# EAGLE design H_V21 (EAGLE 4.13)
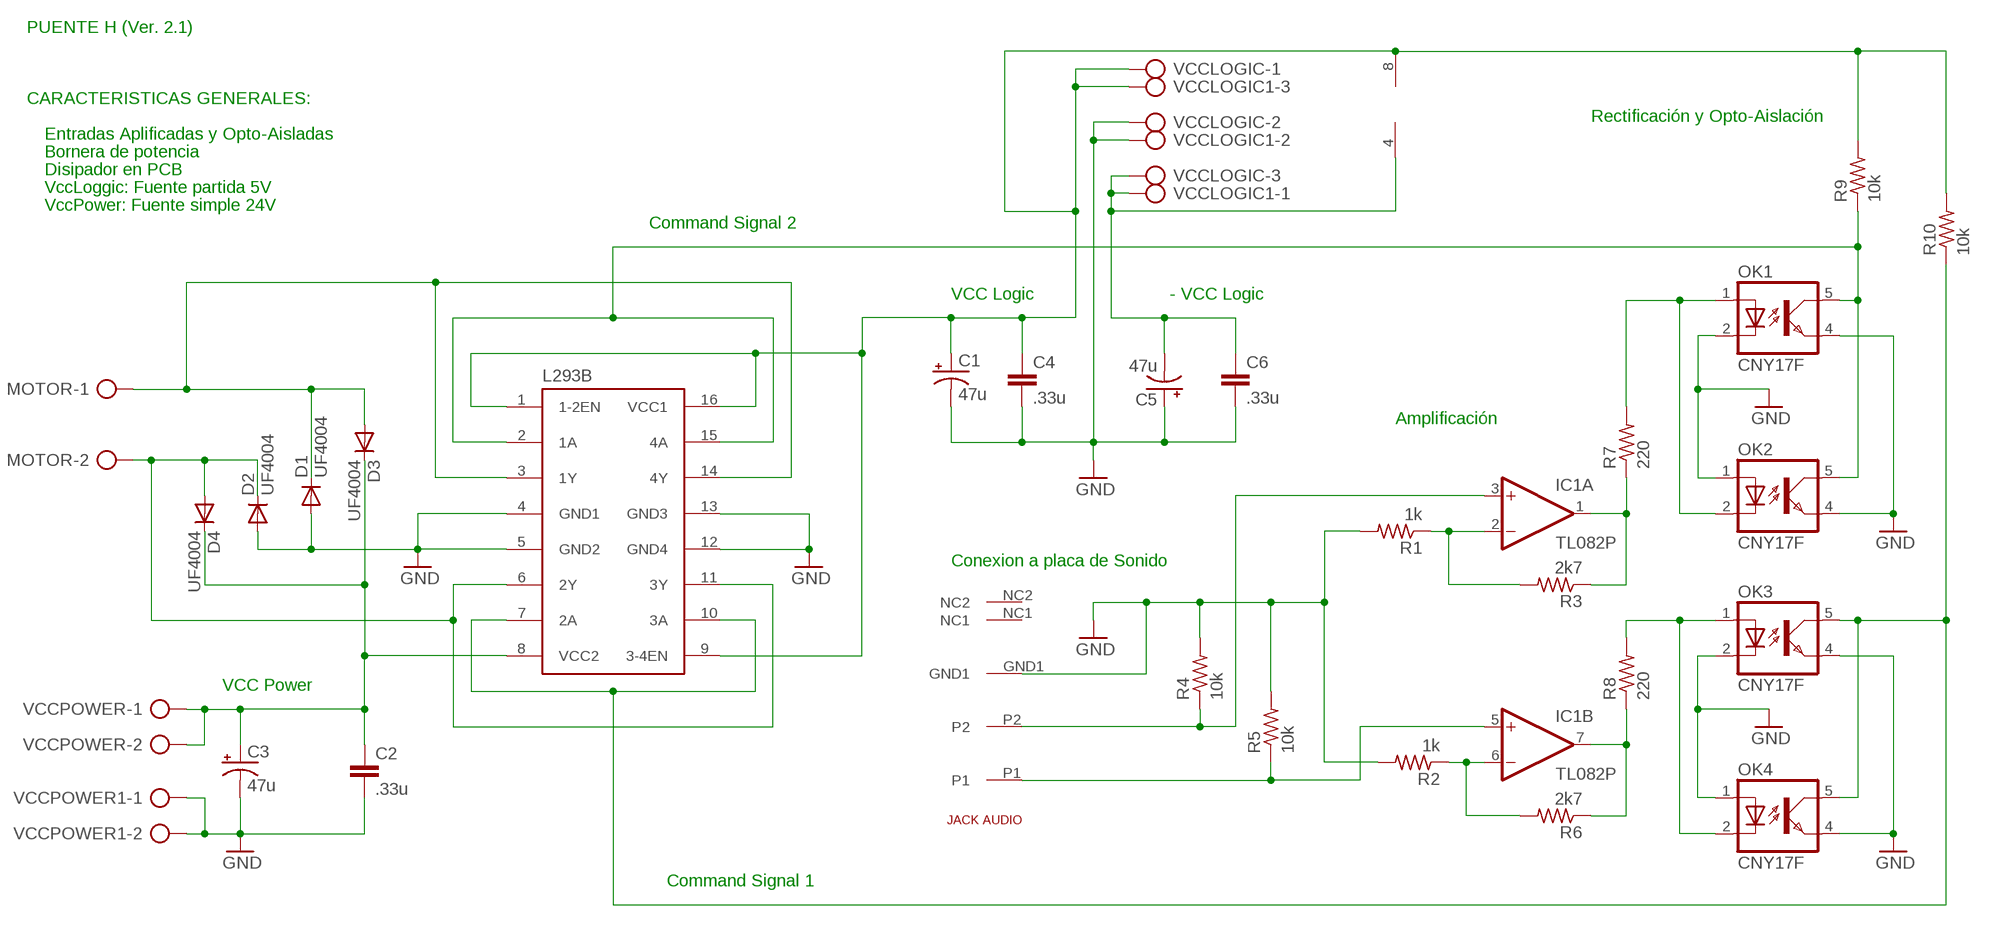
[diagram p0: schematic, sheet 1]

## Parts
C1  47u  CPOL-USE3.5-8  [E3,5-8]
C2  .33u  C2,5-3  [C2.5-3]
C3  47u  CPOL-USE3.5-8  [E3,5-8]
C4  .33u  C2,5-3  [C2.5-3]
C5  47u  CPOL-USE3.5-8  [E3,5-8]
C6  .33u  C2,5-3  [C2.5-3]
D1  UF4004  1N4004  [DO41-10]
D2  UF4004  1N4004  [DO41-10]
D3  UF4004  1N4004  [DO41-10]
D4  UF4004  1N4004  [DO41-10]
IC1  TL082P  [DIL08]
JACKAUDIO1  JACKAUDIO  [ZOCALOGUS]
L293B  L293E  [DIL16]
MOTOR  AK300/2  [AK300/2]
OK1  CNY17F  [DIL06]
OK2  CNY17F  [DIL06]
OK3  CNY17F  [DIL06]
OK4  CNY17F  [DIL06]
R1  1k  R-US_0207/12  [0207/12]
R2  1k  R-US_0207/12  [0207/12]
R3  2k7  R-US_0207/12  [0207/12]
R4  10k  R-US_0207/12  [0207/12]
R5  10k  R-US_0207/12  [0207/12]
R6  2k7  R-US_0207/12  [0207/12]
R7  220  R-US_0207/12  [0207/12]
R8  220  R-US_0207/12  [0207/12]
R9  10k  R-US_0207/12  [0207/12]
R10  10k  R-US_0207/12  [0207/12]
VCCLOGIC  AK500/3  [AK500/3]
VCCLOGIC1  AK500/3  [AK500/3]
VCCPOWER  AK300/2  [AK300/2]
VCCPOWER1  AK300/2  [AK300/2]

## Nets
GND: C1.- C2.2 C3.- C4.2 C5.+ C6.2 D1.A D2.A JACKAUDIO1.GND1 L293B.4(GND1) L293B.5(GND2) L293B.12(GND4) L293B.13(GND3) OK1.2(C) OK1.4(EMIT) OK2.1(A) OK2.4(EMIT) OK3.2(C) OK3.4(EMIT) OK4.1(A) OK4.4(EMIT) R1.2 R2.2 R4.2 R5.2 VCCLOGIC1.2 VCCLOGIC.2 VCCPOWER1.1 VCCPOWER1.2
N$1: L293B.7(2A) L293B.10(3A) OK3.5(COL) OK4.5(COL) R10.1
N$2: L293B.2(1A) L293B.15(4A) OK1.5(COL) OK2.5(COL) R9.1
N$3: OK3.1(A) OK4.2(C) R8.2
N$5: C1.+ C4.1 IC1.8(P:V+) L293B.1(1-2EN) L293B.9(3-4EN) L293B.16(VCC1) R9.2 R10.2 VCCLOGIC1.3 VCCLOGIC.1
N$6: IC1.5(B:+IN) JACKAUDIO1.P1 R5.1
N$7: IC1.3(A:+IN) JACKAUDIO1.P2 R4.1
N$8: C2.1 C3.+ D3.C D4.C L293B.8(VCC2) VCCPOWER.1 VCCPOWER.2
N$9: IC1.2(A:-IN) R1.1 R3.2
N$10: D2.C D4.A L293B.6(2Y) L293B.11(3Y) MOTOR.2
N$11: D1.C D3.A L293B.3(1Y) L293B.14(4Y) MOTOR.1
N$12: IC1.6(B:-IN) R2.1 R6.2
N$13: OK1.1(A) OK2.2(C) R7.2
N$14: C5.- C6.1 IC1.4(P:V-) VCCLOGIC1.1 VCCLOGIC.3
N$16: IC1.1(A:OUT) R3.1 R7.1
N$17: IC1.7(B:OUT) R6.1 R8.1
Unconnected: JACKAUDIO1.NC1 JACKAUDIO1.NC2

## Notes on the sheet
- PUENTE H (Ver. 2.1)
- CARACTERISTICAS GENERALES:
- Rectificación y Opto-Aislación
- Entradas Aplificadas y Opto-Aisladas
- Bornera de potencia
- Disipador en PCB
- VccLoggic: Fuente partida 5V
- VccPower: Fuente simple 24V
- Command Signal 2
- VCC Logic | - VCC Logic
- Amplificación
- Conexion a placa de Sonido
- VCC Power
- Command Signal 1

## Library data of the parts
C1 C3 C5 = rcl:CPOL-US: POLARIZED CAPACITOR, American symbol
C2 C4 C6 = capacitor-wima:C: CAPACITOR naming: grid - package width
D1-D4 = diode:1N4004: DIODE general purpose rectifier, 1 A
IC1 = linear:TL082: OP AMP
JACKAUDIO1 = con-gus:JACKAUDIO
L293B = texas:L293E: TI DEVICE
MOTOR VCCPOWER VCCPOWER1 = con-ptr500:AK300/2: CONNECTOR
OK1-OK4 = optocoupler:CNY17F: SIEMENS OPTO COUPLER
R1-R10 = rcl:R-US_: RESISTOR, American symbol
VCCLOGIC VCCLOGIC1 = con-ptr500:AK500/3: CONNECTOR

## Board
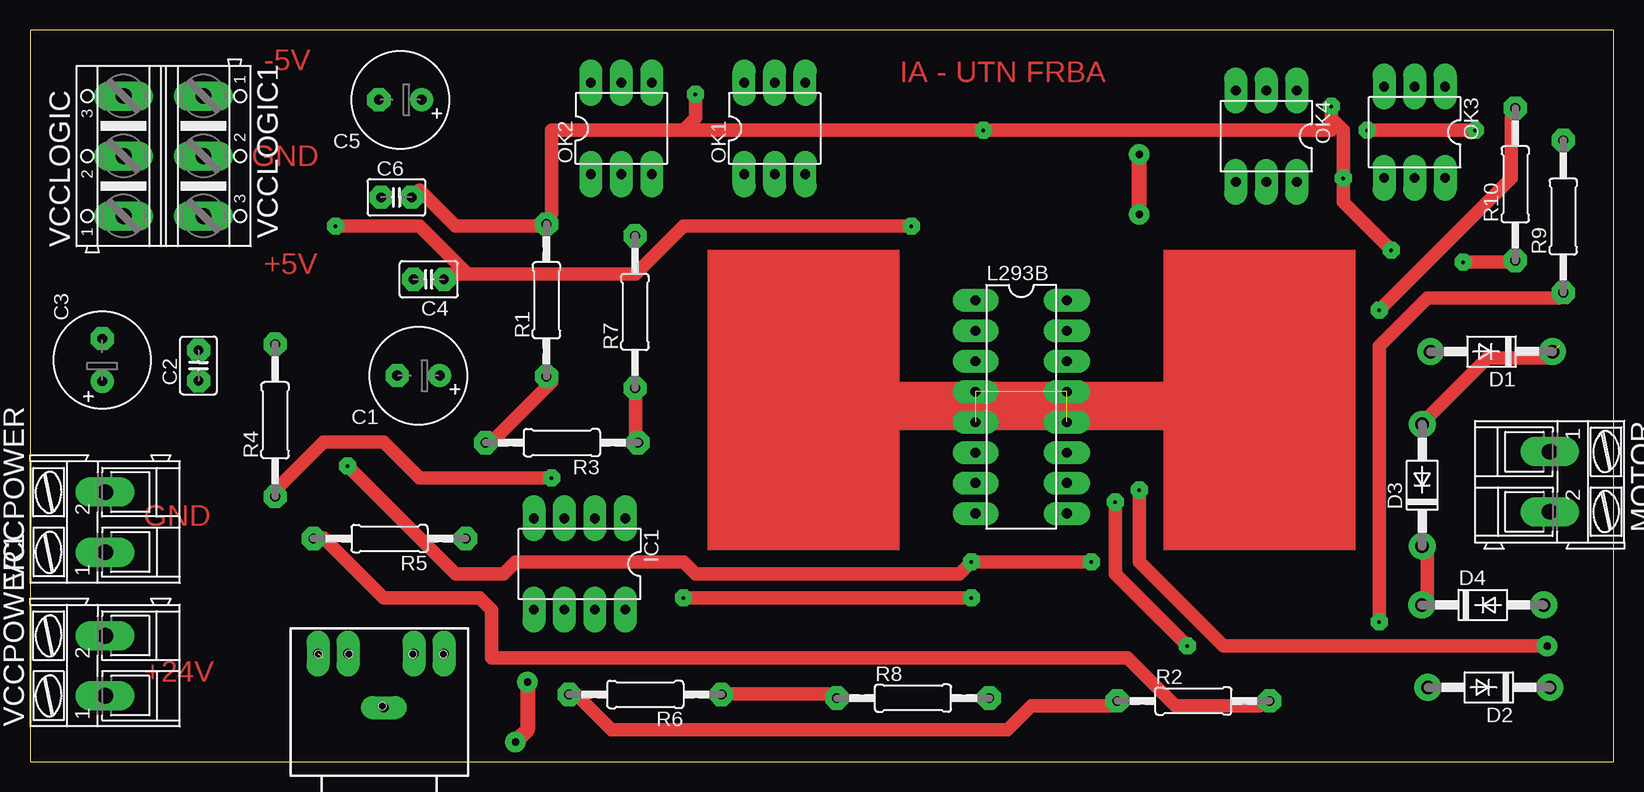
[diagram p1: board, top side]
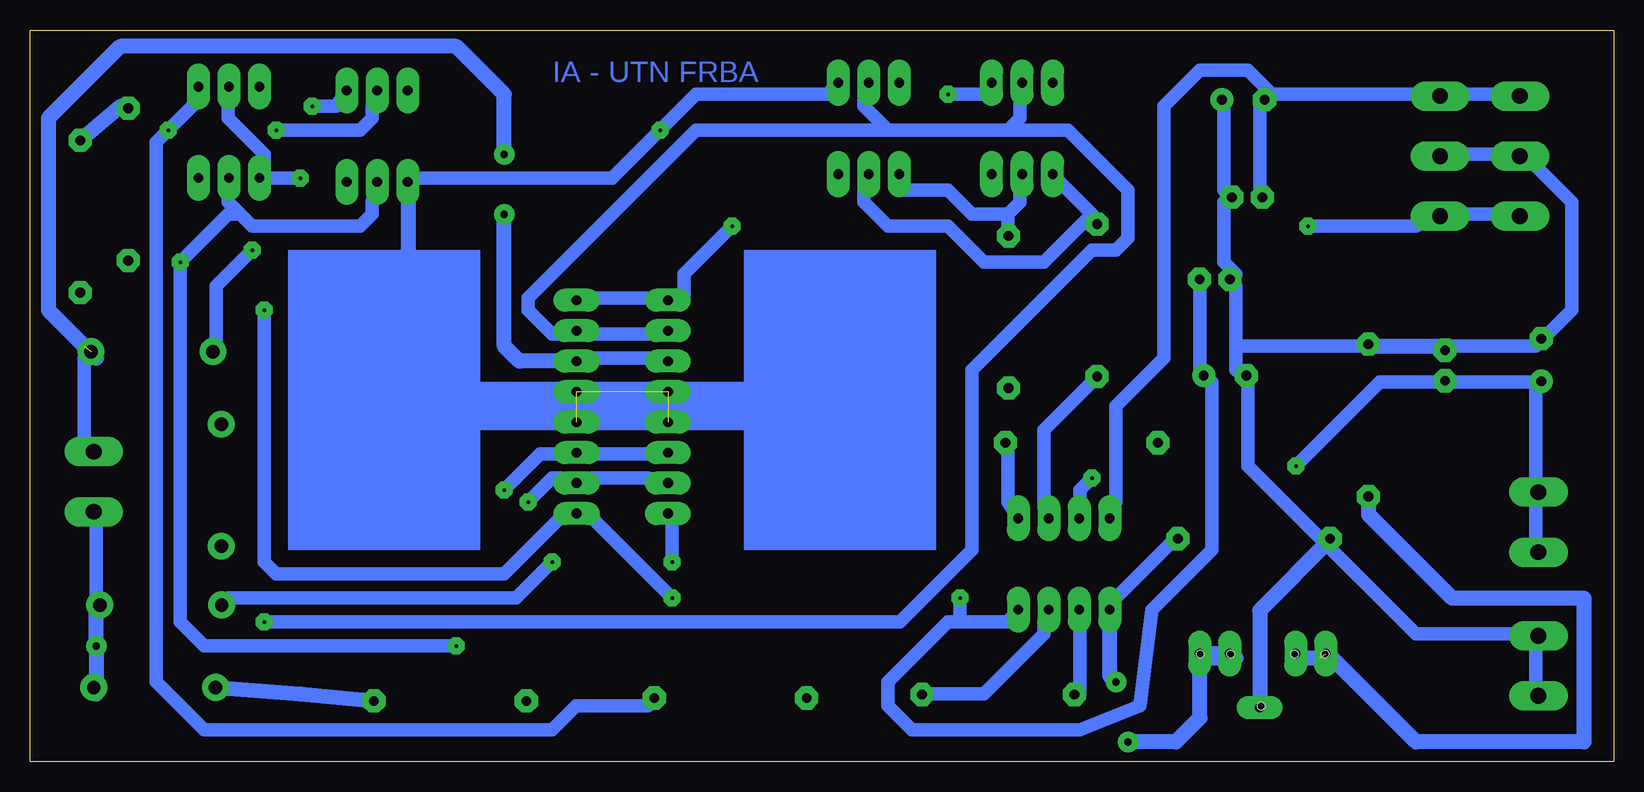
[diagram p2: board, bottom side, seen from below]

Size 132 x 61 mm. Coordinates in mm from the lower left corner, seen from the top.
Outline: 0,0 132,0 132,61 0,61 0,0
Copper layers (1*16): Top 0.035mm / dielectric 1.5mm / Bottom 0.035mm
Design rules "default": minimum track width 44mil, minimum drill 12mil, track to track 22mil, track to pad 22mil, pad to pad 22mil, via to via 22mil, smd to smd 8mil, copper to edge 40mil, drill to drill 8mil, minimum pad ring 22mil, minimum via ring 22mil, stop-mask expansion 4mil, vias tented up to drill 0mil, thermal gap 10mil
tRestrict: area 2.5,41.6 to 19.5,58.6; area 2.5,3.6 to 11.5,24.6; area 21.5,2.6 to 37.5,12.6; area 76.5,17.6 to 89.5,42.6; area 39.5,17.6 to 52.5,22.6; area 39.5,9.6 to 52.5,14.6; area 44.5,53.6 to 54.5,59.6; area 44.5,46.6 to 54.5,51.6; area 57.5,54.6 to 67.5,59.6; area 57.5,46.6 to 67.5,50.6; area 97.5,53.6 to 107.5,58.6; area 97.5,46.6 to 108.5,51.6; 6 more areas
vRestrict: area 60.5,17.6 to 72.5,42.6; area 94.5,17.6 to 106.5,42.6; area 72.5,27.6 to 94.5,31.6; area 56.5,17.6 to 60.5,42.6; area 106.5,17.6 to 110.5,42.6

### Footprints (pad centres in the part's own frame; a part is rotated, then mirrored left to right if it is on the bottom)
E3,5-8 = drill 0.813 pad 1.6 round: + -1.778,0 | drill 0.813 pad 1.6 octagon: - 1.778,0
C2.5-3 = drill 0.813 pad 1.6 octagon: 1 -1.27,0; 2 1.27,0
DO41-10 = drill 1.118 round: A 5.08,0; C -5.08,0
DIL08 = drill 0.813 long: 1 -3.81,-3.81; 2 -1.27,-3.81; 3 1.27,-3.81; 4 3.81,-3.81; 5 3.81,3.81; 6 1.27,3.81; 7 -1.27,3.81; 8 -3.81,3.81
ZOCALOGUS = drill 0.8 long: GND1 7.5,7; NC1 5,2.5; NC2 10.5,2.5; P1 2.5,2.5; P2 13,2.5 | hole 0.6: 2.54,2.54; 12.97,2.54; 5.08,2.54; 10.43,2.54; 7.62,6.89
DIL16 = drill 0.813 long: 1 -8.89,-3.81; 2 -6.35,-3.81; 3 -3.81,-3.81; 4 -1.27,-3.81; 5 1.27,-3.81; 6 3.81,-3.81; 7 6.35,-3.81; 8 8.89,-3.81; 9 8.89,3.81; 10 6.35,3.81; 11 3.81,3.81; 12 1.27,3.81; 13 -1.27,3.81; 14 -3.81,3.81; 15 -6.35,3.81; 16 -8.89,3.81
AK300/2 = drill 1.321 long: 1 -2.515,0; 2 2.489,0
DIL06 = drill 0.813 long: 1 -2.54,-3.81; 2 0,-3.81; 3 2.54,-3.81; 4 2.54,3.81; 5 0,3.81; 6 -2.54,3.81
0207/12 = drill 0.813 octagon: 1 -6.35,0; 2 6.35,0
AK500/3 = drill 1.321 long: 1 -5.004,0; 2 0,0; 3 5.004,0

### Placement (x,y rotation side)
C1  32.38,32.18 180 top
C2  14.05,33.02 90 top
C3  6.02,33.48 90 top
C4  33.24,40.21 180 top
C5  30.86,55.18 180 top
C6  30.54,47.05 0 top
D1  121.83,34.18 180 top
D2  121.61,6.18 180 top
D3  116.05,23.04 90 top
D4  121.1,13.05 0 top
IC1  45.81,16.47 180 top
JACKAUDIO1  37,11.5 180 top
L293B  82.63,29.57 270 top
MOTOR  126.68,23.32 270 top
OK1  62.08,52.79 0 top
OK2  49.3,52.79 0 top
OK3  115.42,52.47 180 top
OK4  103.06,52.15 180 top
R1  43.05,38.46 90 top
R2  96.98,5.05 0 top
R3  44.33,26.59 180 top
R4  20.43,28.45 90 top
R5  29.97,18.59 180 top
R6  51.29,5.59 180 top
R7  50.43,37.49 90 top
R8  73.61,5.29 0 top
R9  127.81,45.45 90 top
R10  123.81,48.13 90 top
VCCLOGIC  7.8,50.49 90 top
VCCLOGIC1  14.46,50.49 270 top
VCCPOWER  6.26,19.97 90 top
VCCPOWER1  6.26,8 90 top

### Tracks (layer width: path | path; a pad name or v marks a point on that pad's centre or on a via)
GND  (via drill 0.3)  (3 unrouted)
  Top 1.118: v55.47,55.63 55.47,53.63 54.47,52.63 | 54.47,52.63 43.47,52.63 43.47,45.63 R1.2 42.47,44.63 35.47,44.63 32.47,47.63 C6.2 | 108.47,53.63 108.47,52.63 v79.47,52.63 54.47,52.63 | 108.47,53.63 v108.47,54.63 | v113.47,42.63 109.47,46.63 v109.47,48.63 109.47,52.63 108.47,53.63 | R2.2 102.47,4.63 95.47,4.63 91.47,8.63 38.47,8.63 38.47,12.63 37.47,13.63 29.47,13.63 24.47,18.63 R5.2
  Bottom 1.118: OK4.4 100.47,48.63 83.47,48.63 v79.47,52.63 76.47,55.63 65.47,55.63 OK1.4 | OK3.2 115.47,54.63 115.47,53.63 112.47,50.63 112.47,49.63 OK3.4 112.47,48.63 v109.47,48.63 | 43.47,45.63 46.47,48.63 OK2.1 | 43.47,45.63 47.47,41.63 52.47,41.63 55.47,44.63 60.47,44.63 62.47,46.63 62.47,47.63 OK1.2 | R1.2 43.47,45.63 | v55.47,55.63 52.47,55.63 OK2.4 | v108.47,54.63 106.47,54.63 OK4.1 | v113.47,42.63 116.47,39.63 116.47,34.63 D1.A | VCCLOGIC1.2 12.47,50.63 9.47,50.63 VCCLOGIC.2 6.47,49.63 3.47,46.63 3.47,37.63 5.47,35.63 C3.- 6.47,34.63 13.47,34.63 C2.2 | C5.+ 32.47,54.63 32.47,47.63 C6.2 32.47,46.63 32.47,41.63 31.47,40.63 C4.2 31.47,39.63 31.47,34.63 | VCCPOWER1.1 6.47,6.63 6.47,9.63 VCCPOWER1.2 8.47,10.63 16.47,10.63 23.47,17.63 R5.2 24.47,18.63 30.47,24.63 30.47,31.63 C1.- 31.47,32.63 31.47,34.63 | 31.47,34.63 20.47,34.63
  Bottom 1.27: 23.51,18.59 23.47,18.63 | R5.2 23.51,18.59 | JACKAUDIO1.GND1 29.5,12.6 23.51,18.59 | L293B.5 94.14,28.3 100.47,34.63 100.47,48.63 100.47,48.39 OK4.4 | C2.2 14.47,34.63 20.47,34.63 R4.2 | R2.2 109.47,5.63 D2.A
N$1  (via drill 0.3)
  Top 1.118: v119.47,41.63 123.47,41.63 R10.1 | v90.47,21.63 90.47,15.63 v96.47,9.63
  Bottom 1.118: L293B.7 80.47,23.63 85.47,23.63 L293B.10 87.47,23.63 88.47,23.63 v90.47,21.63 | 114.47,45.63 115.47,46.63 115.47,47.63 OK3.5 | 114.47,45.63 113.47,44.63 104.47,44.63 103.47,45.63 103.47,46.63 OK4.5 | 114.47,45.63 115.47,45.63 v119.47,41.63 119.47,11.63 117.47,9.63 v96.47,9.63
N$2  (via drill 0.3)
  Top 1.118: v112.47,11.63 112.47,34.63 116.47,38.63 127.47,38.63 R9.1
  Bottom 1.118: L293B.2 80.47,35.63 85.47,35.63 L293B.15 87.47,35.63 88.47,35.63 90.47,37.63 90.47,38.63 76.47,52.63 60.47,52.63 | 50.47,52.63 49.47,53.63 49.47,55.63 OK2.5 | 50.47,52.63 60.47,52.63 | 60.47,52.63 62.47,54.63 62.47,55.63 OK1.5 | v112.47,11.63 59.47,11.63 53.47,17.63 53.47,32.63 43.47,42.63 41.47,42.63 40.47,43.63 40.47,47.63 45.47,52.63 50.47,52.63
N$3  (via drill 0.3)
  Top 1.118: v120.47,52.63 v111.47,52.63
  Bottom 1.118: 119.47,53.63 118.47,54.63 OK3.1 | 119.47,53.63 121.47,51.63 121.47,6.63 117.47,2.63 88.47,2.63 86.47,4.63 80.47,4.63 R8.2 | v111.47,52.63 104.47,52.63 103.47,53.63 103.47,54.63 OK4.2 | 119.47,53.63 v120.47,52.63
N$4  (via drill 0.6)
  other vias: 92.47,50.63
N$5  (via drill 0.3)
  Top 1.118: v54.47,13.63 v78.47,13.63 | v112.47,37.63 123.47,48.63 123.47,53.63 R10.2 | v73.47,44.63 54.47,44.63 50.47,40.63 36.47,40.63 | 36.47,40.63 34.47,40.63 C4.1 | v25.47,44.63 32.47,44.63 36.47,40.63
  Bottom 1.118: VCCLOGIC.1 9.47,45.63 12.47,45.63 VCCLOGIC1.3 16.47,44.63 v25.47,44.63 | L293B.16 85.47,38.63 80.47,38.63 L293B.1 77.47,38.63 77.47,40.63 v73.47,44.63 | 54.47,11.63 55.47,11.63 60.47,6.63 60.47,4.63 58.47,2.63 44.47,2.63 39.47,4.63 38.47,12.63 33.47,17.63 33.47,31.63 C1.+ 34.47,32.63 34.47,39.63 C4.1 | 54.47,11.63 50.47,11.63 IC1.8 | v78.47,13.63 85.47,20.63 L293B.9 87.47,20.63 92.47,15.63 111.47,15.63 112.47,16.63 v112.47,37.63 | 54.47,11.63 v54.47,13.63
  Bottom 1.27: R9.2 124.47,54.63 123.47,54.63 R10.2
N$6  (via drill 0.6)
  Top 1.27: v41.47,6.63 41.47,2.63 v40.47,1.63
  Bottom 1.118: IC1.5 41.47,13.63 36.47,18.63 R5.1
  Bottom 1.27: JACKAUDIO1.P1 31.84,9 31.47,8.63 34.47,8.63 34.47,3.63 36.47,1.63 v40.47,1.63 | IC1.5 42,7.16 v41.47,6.63
N$7  (via drill 0.3)  (1 unrouted)
  Top 1.118: v43.47,23.63 32.47,23.63 29.47,26.63 24.47,26.63 20.47,22.63 R4.1
  Bottom 1.118: v43.47,23.63 44.47,22.63 44.47,21.63 IC1.3
  Bottom 1.27: R4.1 20.43,20.59 13.47,13.63 2.47,13.63 2.47,1.63 16.47,1.63 23.47,8.63 24.47,8.63 26.47,8.63
N$8  (via drill 0.3)
  Top 1.118: v88.47,16.63 v78.47,16.63 77.47,15.63 55.47,15.63 54.47,16.63 40.47,16.63 39.47,15.63 35.47,15.63 v26.47,24.63 | D3.C 116.47,17.63 116.47,13.63 D4.C
  Bottom 1.118: VCCPOWER.1 6.47,18.63 6.47,21.63 VCCPOWER.2 6.47,23.63 6.47,31.63 | 6.47,31.63 13.47,31.63 C2.1 14.47,31.63 19.47,31.63 v26.47,24.63 | 6.47,31.63 C3.+ | v78.47,16.63 78.47,20.63 L293B.8 | v88.47,16.63 91.47,13.63 115.47,13.63 D4.C
N$9
  Top 1.118: R3.2 38.47,26.63 43.47,31.63 R1.1
  Bottom 1.118: IC1.2 47.47,21.63 47.47,27.63 43.47,31.63 R1.1
N$10  (via drill 0.3, 0.6)
  Top 1.118: D4.A 126.47,12.63 | v92.47,22.63 92.47,16.63 99.47,9.63 v126.47,9.63
  Bottom 1.118: L293B.6 80.47,25.63 85.47,25.63 L293B.11 87.47,25.63 89.47,25.63 v92.47,22.63 | D4.A 126.47,13.63 126.47,19.63 MOTOR.2
  Bottom 1.27: 126.47,12.63 v126.47,9.63 126.47,6.63 | 126.47,6.63 D2.C | 126.47,5.63 126.47,6.63
N$11  (via drill 0.6)  (1 unrouted)
  Top 1.118: D3.A 116.47,28.63 121.47,33.63 126.47,33.63 D1.C
  Top 1.27: v92.47,45.63 v92.47,50.63
  Bottom 1.118: MOTOR.1 127.47,26.63 127.47,33.63 D1.C | L293B.3 80.47,33.63 85.47,33.63 L293B.14
  Bottom 1.27: L293B.14 91.22,33.38 92.47,34.63 v92.47,45.63 | v92.47,50.63 92.47,55.63 96.47,59.63 124.47,59.63 130.47,53.63 130.47,37.63 127.47,34.63 126.47,33.63
N$12
  Top 1.118: R2.1 90.47,4.63 83.47,4.63 81.47,2.63 48.47,2.63 45.47,5.63 R6.2
  Bottom 1.118: R6.2 44.47,5.63 44.47,11.63 IC1.6
N$13
  Bottom 1.118: 50.47,45.63 50.47,44.63 R7.2 | 50.47,45.63 49.47,46.63 49.47,47.63 OK2.2 | 50.47,45.63 53.47,45.63 55.47,47.63 59.47,47.63 OK1.1
N$14
  Bottom 1.118: VCCLOGIC.3 9.47,55.63 12.47,55.63 VCCLOGIC1.1 16.47,55.63 28.47,55.63 | 28.47,55.63 30.47,57.63 34.47,57.63 37.47,54.63 37.47,33.63 41.47,29.63 41.47,21.63 IC1.4 | C6.1 29.47,47.63 29.47,54.63 C5.- 28.47,55.63
N$16
  Top 1.118: R7.1 50.47,30.63 50.47,26.63 R3.1
  Bottom 1.118: IC1.1 50.47,21.63 50.47,25.63 R3.1
N$17
  Top 1.118: R8.1 66.47,5.63 58.47,5.63 R6.1
  Bottom 1.118: IC1.7 47.47,11.63 47.47,10.63 52.47,5.63 57.47,5.63 R6.1
(copper drawn outside any net)
  shapes: Bottom area x6, Top area x5

### Text on the board
Top: -5V | IA - UTN FRBA | GND | +5V | GND | +24V
Bottom: IA - UTN FRBA